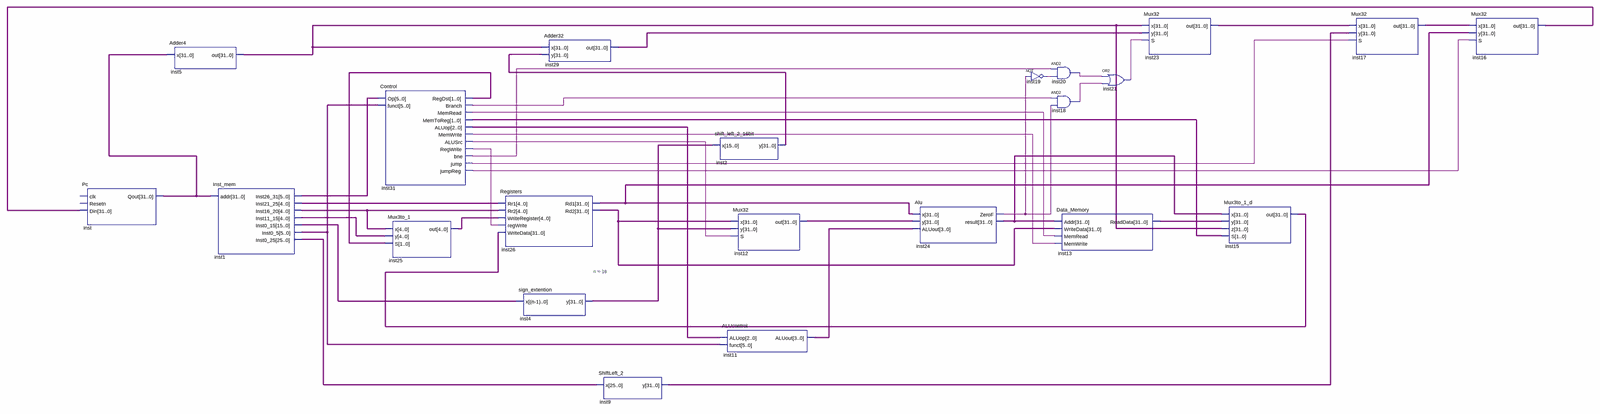
[diagram p0: schematic sheet, whole]
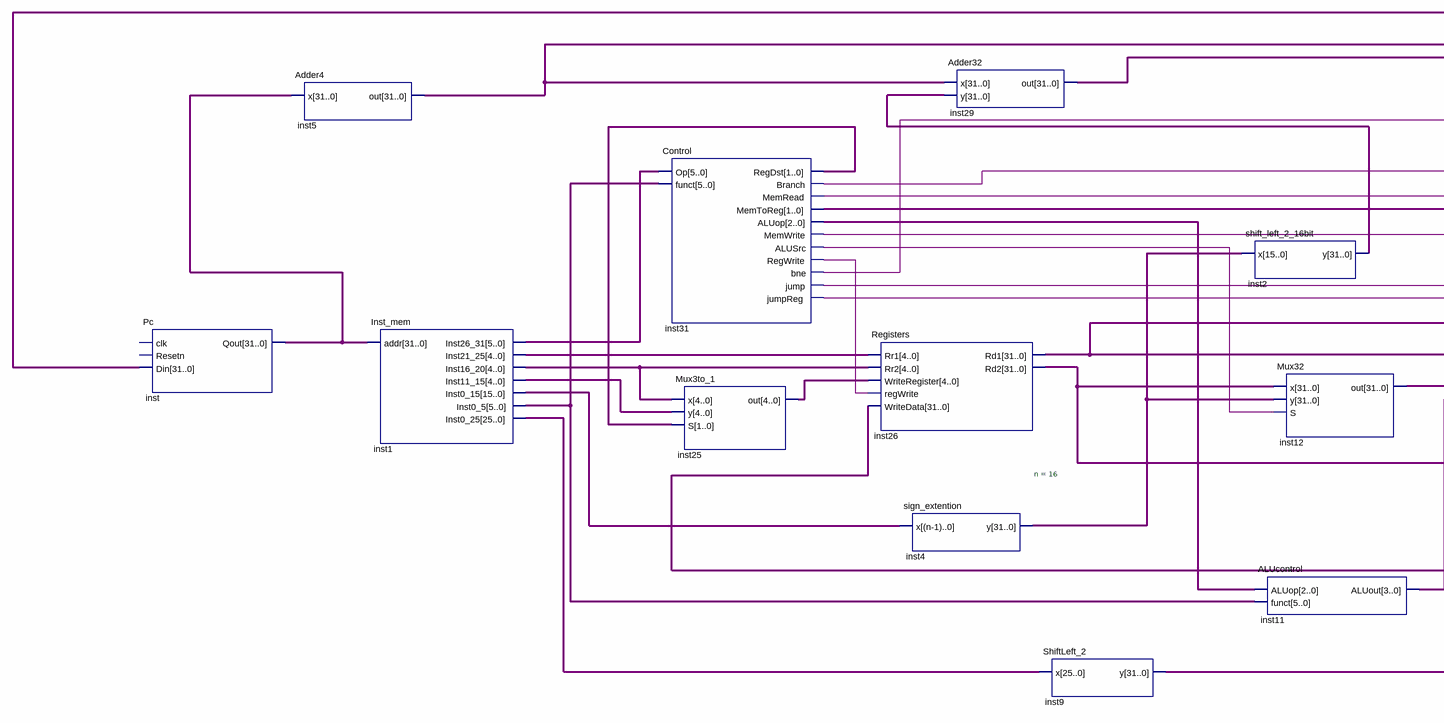
[diagram p1: schematic sheet, left part]
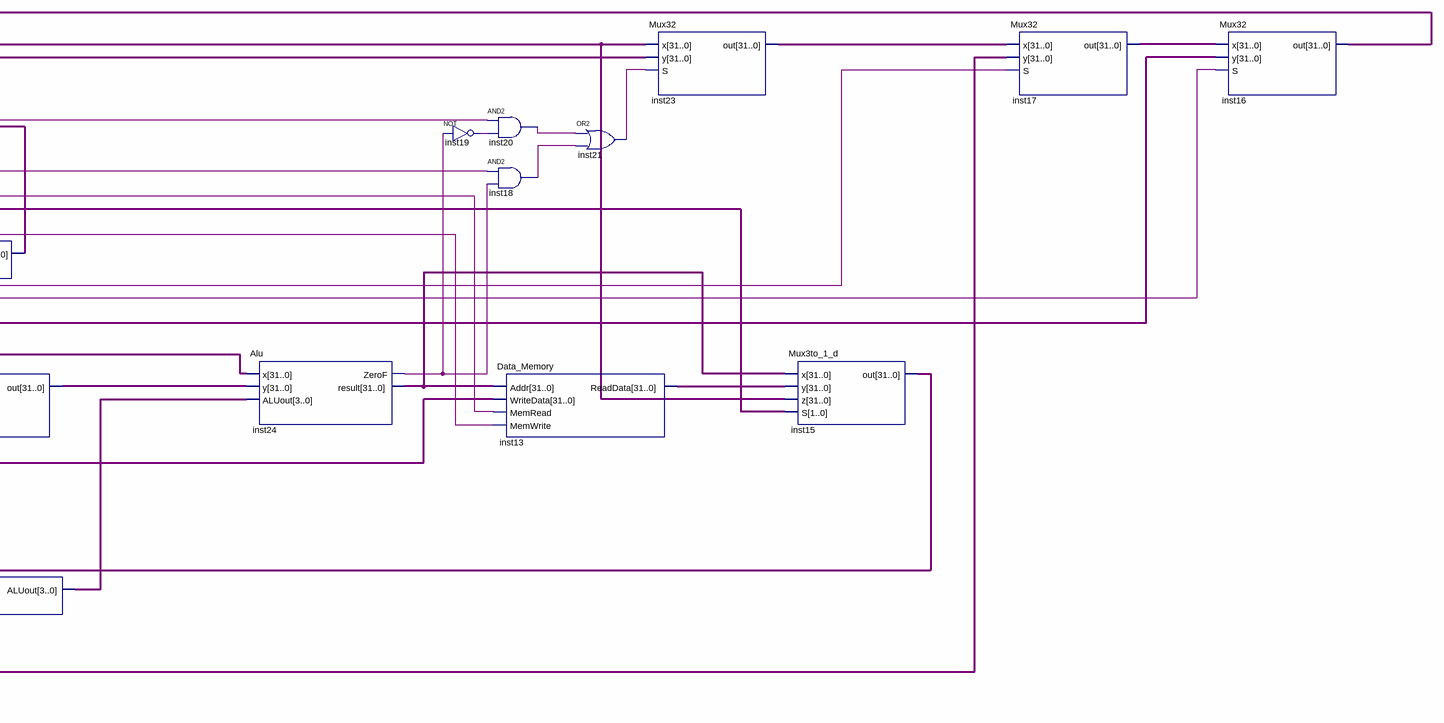
[diagram p2: schematic sheet, right part]
// Quartus schematic lab_David.bdf as structural Verilog: 22 symbols, 0 pins
module lab_David (
);

  wire inst18_out, inst19_out, inst20_out, inst21_out, inst24_zerof, inst31_alusrc, inst31_bne,
       inst31_branch, inst31_jump, inst31_jumpreg, inst31_memread, inst31_memwrite, inst31_regwrite;
  wire [1:0] inst31_memtoreg, inst31_regdst;
  wire [2:0] inst31_aluop;
  wire [3:0] inst11_aluout;
  wire [4:0] inst1_inst11_15, inst1_inst16_20, inst1_inst21_25, inst25_out;
  wire [5:0] inst1_inst0_5, inst1_inst26_31;
  wire [15:0] inst1_inst0_15;
  wire [25:0] inst1_inst0_25;
  wire [31:0] inst2_y, inst4_y, inst5_out, inst9_y, inst12_out, inst13_readdata, inst15_out, inst16_out,
       inst17_out, inst23_out, inst24_result, inst26_rd1, inst26_rd2, inst29_out, inst_qout;

  Pc inst (.Din(inst16_out), .Qout(inst_qout));  // open: clk, Resetn
  Adder4 inst5 (.x(inst_qout), .out(inst5_out));
  Inst_mem inst1 (
    .addr(inst_qout), .Inst26_31(inst1_inst26_31), .Inst21_25(inst1_inst21_25), .Inst16_20(inst1_inst16_20),
    .Inst11_15(inst1_inst11_15), .Inst0_15(inst1_inst0_15), .Inst0_5(inst1_inst0_5), .Inst0_25(inst1_inst0_25));
  Control inst31 (
    .Op(inst1_inst26_31), .funct(inst1_inst0_5), .RegDst(inst31_regdst), .Branch(inst31_branch),
    .MemRead(inst31_memread), .MemToReg(inst31_memtoreg), .ALUop(inst31_aluop), .MemWrite(inst31_memwrite),
    .ALUSrc(inst31_alusrc), .RegWrite(inst31_regwrite), .bne(inst31_bne), .jump(inst31_jump),
    .jumpReg(inst31_jumpreg));
  Mux3to_1 inst25 (.x(inst1_inst16_20), .y(inst1_inst11_15), .S(inst31_regdst), .out(inst25_out));
  Registers inst26 (
    .Rr1(inst1_inst21_25), .Rr2(inst1_inst16_20), .WriteRegister(inst25_out), .regWrite(inst31_regwrite),
    .WriteData(inst15_out), .Rd1(inst26_rd1), .Rd2(inst26_rd2));
  sign_extention #(.n(16)) inst4 (.x(inst1_inst0_15), .y(inst4_y));
  Adder32 inst29 (.x(inst5_out), .y(inst2_y), .out(inst29_out));
  ShiftLeft_2 inst9 (.x(inst1_inst0_25), .y(inst9_y));
  shift_left_2_16bit inst2 (.x(inst4_y), .y(inst2_y));
  Mux32 inst12 (.x(inst26_rd2), .y(inst4_y), .S(inst31_alusrc), .out(inst12_out));
  ALUcontrol inst11 (.ALUop(inst31_aluop), .funct(inst1_inst0_5), .ALUout(inst11_aluout));
  Alu inst24 (.x(inst26_rd1), .y(inst12_out), .ALUout(inst11_aluout), .ZeroF(inst24_zerof), .result(inst24_result));
  and inst20 (inst20_out, inst31_bne, inst19_out);
  not inst19 (inst19_out, inst24_zerof);
  and inst18 (inst18_out, inst31_branch, inst24_zerof);
  Data_Memory inst13 (
    .Addr(inst24_result), .WriteData(inst26_rd2), .MemRead(inst31_memread), .MemWrite(inst31_memwrite),
    .ReadData(inst13_readdata));
  or inst21 (inst21_out, inst20_out, inst18_out);
  Mux32 inst23 (.x(inst5_out), .y(inst29_out), .S(inst21_out), .out(inst23_out));
  Mux3to_1_d inst15 (.x(inst24_result), .y(inst13_readdata), .z(inst5_out), .S(inst31_memtoreg), .out(inst15_out));
  Mux32 inst17 (.x(inst23_out), .y(inst9_y), .S(inst31_jump), .out(inst17_out));
  Mux32 inst16 (.x(inst17_out), .y(inst26_rd1), .S(inst31_jumpreg), .out(inst16_out));
endmodule
